# Altium schematic sheet Sheet1.SchDoc
size A4
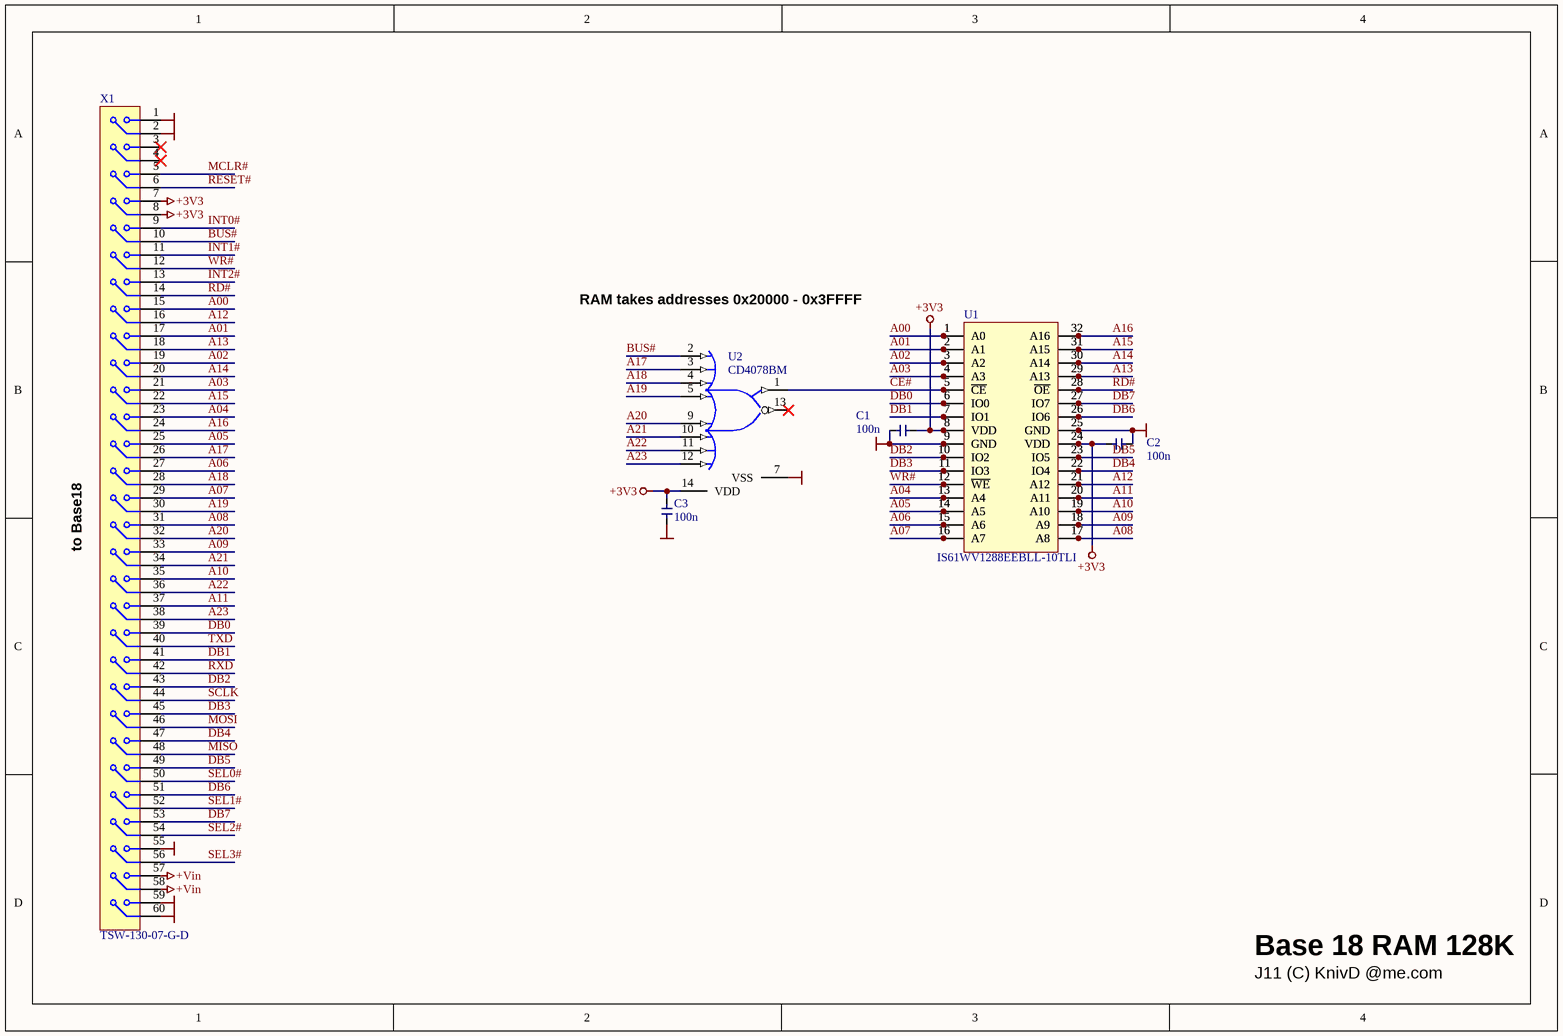
[diagram p0: Sheet1.SchDoc]

## Parts
C1  100n  [CAPC3216X110N]
C2  100n  [CAPC3216X110N]
C3  100n  [CAPC3216X110N]
U1  IS61WV1288EEBLL-10TLI  [SOIC127P1413X280-32N]
U1A  (no value)  [SOJ127P1118X368-32N]
U2  CD4078BM  [SOIC127P600X175-14N]
X1  TSW-130-07-G-D  [DIL60-M-EDGE]

## Nets
+3V3: C1.1 C2.1 C3.1 U1.8(VDD) U1.24(VDD) U1A.8(VDD) U1A.24(VDD) U2.14(VDD) X1.7 X1.8  [also labelled VDD]
+Vin: X1.57 X1.58
GND: C1.2 C2.2 C3.2 U1.9(GND) U1.25(GND) U1A.9(GND) U1A.25(GND) U2.7(VSS) X1.1 X1.2 X1.55 X1.59 X1.60
A00: U1.1(A0) U1A.1(A0) X1.15
A01: U1.2(A1) U1A.2(A1) X1.17
A02: U1.3(A2) U1A.3(A2) X1.19
A03: U1.4(A3) U1A.4(A3) X1.21
A04: U1.13(A4) U1A.13(A4) X1.23
A05: U1.14(A5) U1A.14(A5) X1.25
A06: U1.15(A6) U1A.15(A6) X1.27
A07: U1.16(A7) U1A.16(A7) X1.29
A08: U1.17(A8) U1A.17(A8) X1.31
A09: U1.18(A9) U1A.18(A9) X1.33
A10: U1.19(A10) U1A.19(A10) X1.35
A11: U1.20(A11) U1A.20(A11) X1.37
A12: U1.21(A12) U1A.21(A12) X1.16
A13: U1.29(A13) U1A.29(A13) X1.18
A14: U1.30(A14) U1A.30(A14) X1.20
A15: U1.31(A15) U1A.31(A15) X1.22
A16: U1.32(A16) U1A.32(A16) X1.24
A17: U2.3 X1.26
A18: U2.4 X1.28
A19: U2.5 X1.30
A20: U2.9 X1.32
A21: U2.10 X1.34
A22: U2.11 X1.36
A23: U2.12 X1.38
BUS#: U2.2 X1.10
CE#: U1.5(~{CE}) U1A.5(~{CE}) U2.1
DB0: U1.6(IO0) U1A.6(IO0) X1.39
DB1: U1.7(IO1) U1A.7(IO1) X1.41
DB2: U1.10(IO2) U1A.10(IO2) X1.43
DB3: U1.11(IO3) U1A.11(IO3) X1.45
DB4: U1.22(IO4) U1A.22(IO4) X1.47
DB5: U1.23(IO5) U1A.23(IO5) X1.49
DB6: U1.26(IO6) U1A.26(IO6) X1.51
DB7: U1.27(IO7) U1A.27(IO7) X1.53
INT0#: X1.9
INT1#: X1.11
INT2#: X1.13
MCLR#: X1.5
MISO: X1.48
MOSI: X1.46
RD#: U1.28(~{OE}) U1A.28(~{OE}) X1.14
RESET#: X1.6
RXD: X1.42
SCLK: X1.44
SEL0#: X1.50
SEL1#: X1.52
SEL2#: X1.54
SEL3#: X1.56
TXD: X1.40
WR#: U1.12(~{WE}) U1A.12(~{WE}) X1.12

Not connected (* = marked no-connect by the designer): U2 13*; X1 3* 4*

## Notes on the sheet
- (near U2) RAM takes addresses 0x20000 - 0x3FFFF
- to Base18
- Base 18 RAM 128K
- J11 (C) KnivD @me.com

## Library data of the parts
C1-C3 = Capacitor
U1 = IS63LV1024L: 128k x8 high-speed CMOS static RAM 3.3V; Manufacturer: ISSI
U1A = IS63LV1024L: 128k x8 high-speed CMOS static RAM 3.3V
U2 = CD4078BE: 8-Input NOR Gate; Manufacturer: TEXAS INSTRUMENTS; Table: Standard Logic; Part Number: CD4078BE; Component Kind: Standard; Component Type: Standard; Device: CD4078BE; Footprint: DIP14-300; PackageDescription: DIP; 14 Leads; Row Spacing 7.62 mm; Pitch 2.54 mm; Part Description: 8-Input NOR Gate; Manufacturer Part Number: CD4078BE; Pin Count: 12; Case: DIP14-300; Mounted: Yes; Socket: Yes; SMD: No; ComponentHeight: 5.08mm; Author: CERN DEM JLC; HelpURL: \\cern.ch\dfs\Applications\Altium\Datasheets\CD4078BE.pdf; CreateDate: 21/01/2008; LatestRevisionDate: 13/03/2008
X1 = Connector 2x30: Dual row, 60-way connector